# Altium project 2m_DBoard_TX.PrjPcb (part 2 of 2)

## Sheet Power.SchDoc: {Наименование}
size 420 x 297 mm; ApprovedBy: {Утвердил}; CheckedBy: {Проверил}; DrawnBy: {Разраб.}; DocumentNumber: АБВГ 123456.789 00; SheetNumber: {}; SheetTotal: {}; Scale: {Мш.}; PageSetup: Record=PageOptions|CenterHorizontal=False|CenterVertical=False|PrintScale=0.95|XCorrection=0.00|YCorrection=0.00|PrintKind=1|BorderSize=5000000|LeftOffset=0|BottomOffset=0|Orientation=1|PaperLength=1000|PaperWidth=1000|Scale=100|PaperSource=15|PrintQuality=600|MediaType=1|DitherType=10|PaperKind=A4|PrintScaleMode=1; ProcessInspection: {Т.контр.}; Mass: {М.}; NormInspection: {Н.контр.}; Letter1Column: {}; Letter2Column: {}; Letter3Column: {}; DocumentType: {Документ}; Rule: PcbType=ProtelPcb
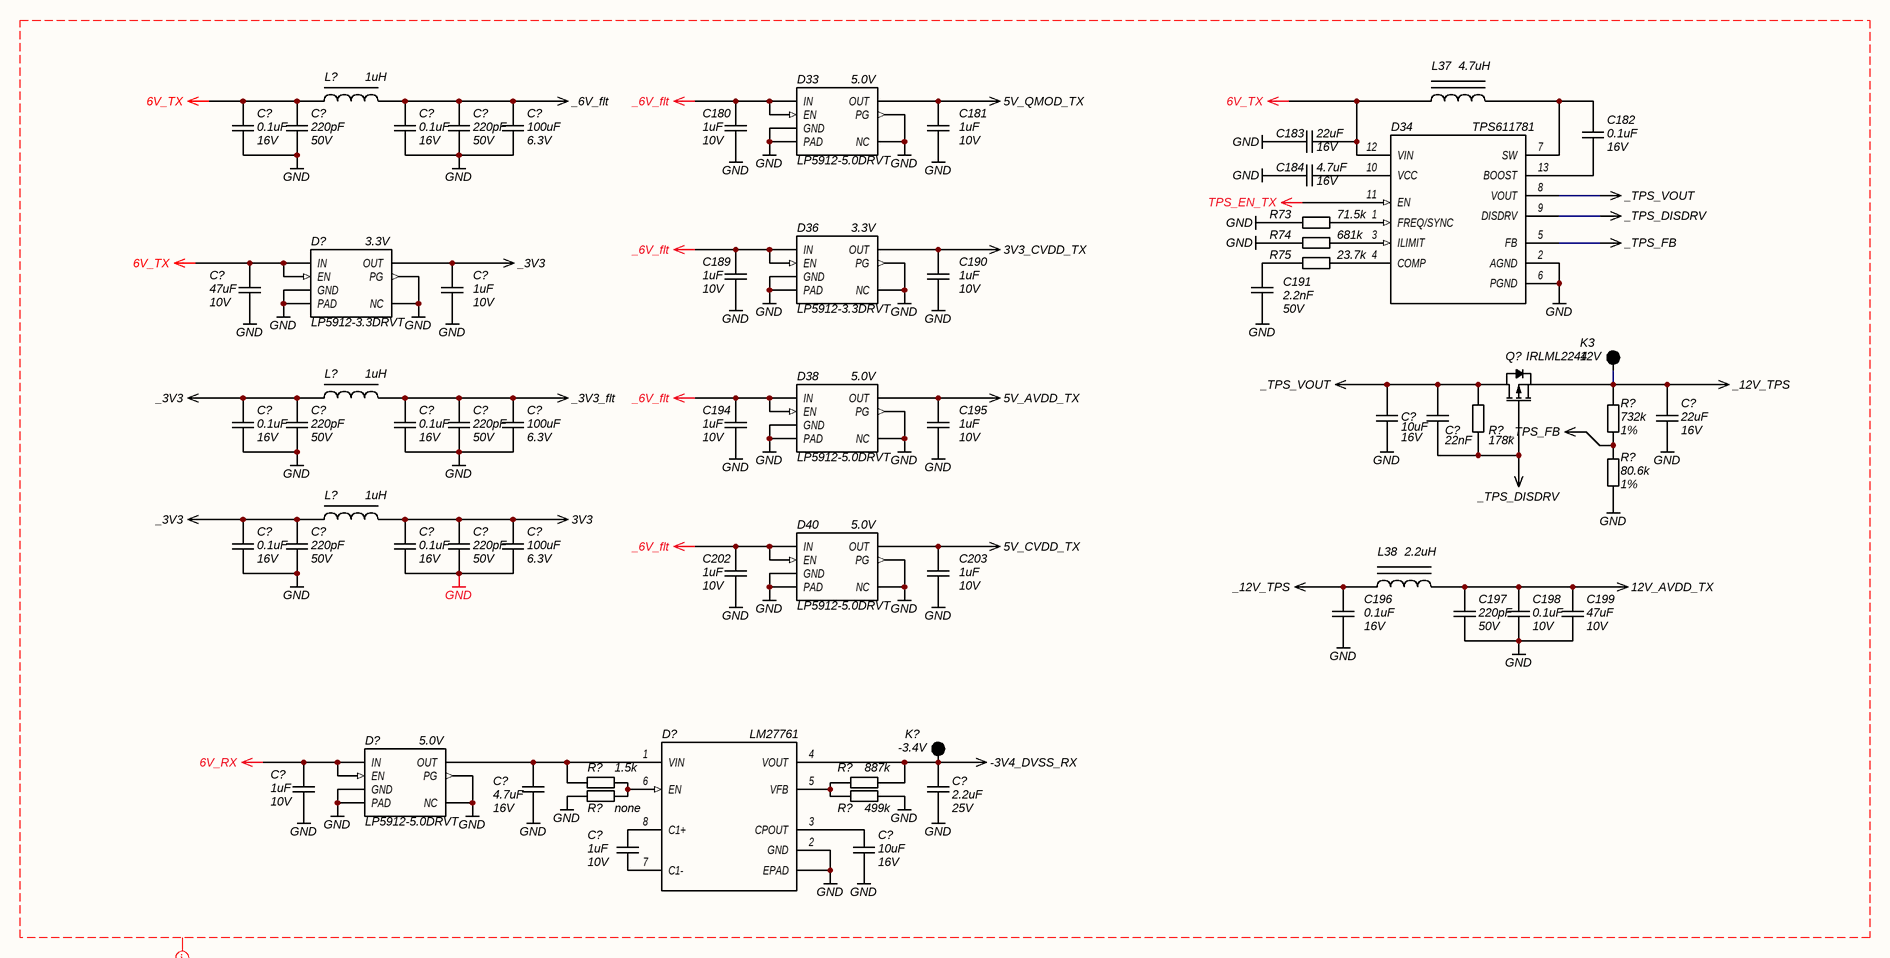
[diagram p6: Power.SchDoc]

### Parts
(Parts that share a designator on the sheet are numbered #1, #2 ... from top to bottom, then left to right.)
C180  value 1uF  Voltage: 10V  [C0805]  (hidden comment: CAP)
C181  value 1uF  Voltage: 10V  [C0805]  (hidden comment: CAP)
C182  value 0.1uF  Voltage: 16V  [C0402]  (hidden comment: CAP)
C183  value 22uF  Voltage: 16V  [C0805]  (hidden comment: CAP uF)
C184  value 4.7uF  Voltage: 16V  [C0603]  (hidden comment: CAP)
C189  value 1uF  Voltage: 10V  [C0805]  (hidden comment: CAP)
C190  value 1uF  Voltage: 10V  [C0805]  (hidden comment: CAP)
C191  value 2.2nF  Voltage: 50V  [C0603]  (hidden comment: CAP)
C194  value 1uF  Voltage: 10V  [C0805]  (hidden comment: CAP)
C195  value 1uF  Voltage: 10V  [C0805]  (hidden comment: CAP)
C196  value 0.1uF  Voltage: 16V  [C0402]  (hidden comment: CAP)
C197  value 220pF  Voltage: 50V  [C0603]  (hidden comment: CAP)
C198  value 0.1uF  Voltage: 10V  [C0402]  (hidden comment: CAP)
C199  value 47uF  Voltage: 10V  [C1210]  (hidden comment: CAP uF)
C202#2  value 1uF  Voltage: 10V  [C0805]  (hidden comment: CAP)
C203#2  value 1uF  Voltage: 10V  [C0805]  (hidden comment: CAP)
C?#3  value 0.1uF  Voltage: 16V  [C0402]  (hidden comment: CAP)
C?#4  value 220pF  Voltage: 50V  [C0603]  (hidden comment: CAP)
C?#5  value 0.1uF  Voltage: 16V  [C0402]  (hidden comment: CAP)
C?#6  value 220pF  Voltage: 50V  [C0603]  (hidden comment: CAP)
C?#7  value 100uF  Voltage: 6.3V  [C1210]  (hidden comment: CAP uF)
C?#8  value 47uF  Voltage: 10V  [C1210]  (hidden comment: CAP uF)
C?#9  value 1uF  Voltage: 10V  [C0805]  (hidden comment: CAP)
C?#10  value 10uF  Voltage: 16V  [C0805]  (hidden comment: CAP uF)
C?#11  value 22nF  [C0402]  (hidden comment: CAP)
C?#12  value 22uF  Voltage: 16V  [C0805]  (hidden comment: CAP uF)
C?#13  value 0.1uF  Voltage: 16V  [C0402]  (hidden comment: CAP)
C?#14  value 220pF  Voltage: 50V  [C0603]  (hidden comment: CAP)
C?#15  value 0.1uF  Voltage: 16V  [C0402]  (hidden comment: CAP)
C?#16  value 220pF  Voltage: 50V  [C0603]  (hidden comment: CAP)
C?#17  value 100uF  Voltage: 6.3V  [C1210]  (hidden comment: CAP uF)
C?#18  value 0.1uF  Voltage: 16V  [C0402]  (hidden comment: CAP)
C?#19  value 220pF  Voltage: 50V  [C0603]  (hidden comment: CAP)
C?#20  value 0.1uF  Voltage: 16V  [C0402]  (hidden comment: CAP)
C?#21  value 220pF  Voltage: 50V  [C0603]  (hidden comment: CAP)
C?#22  value 100uF  Voltage: 6.3V  [C1210]  (hidden comment: CAP uF)
C?#23  value 1uF  Voltage: 10V  [C0805]  (hidden comment: CAP)
C?#24  value 4.7uF  Voltage: 16V  [C0603]  (hidden comment: CAP)
C?#25  value 2.2uF  Voltage: 25V  [C0603]  (hidden comment: CAP)
C?#26  value 1uF  Voltage: 10V  [C0805]  (hidden comment: CAP)
C?#27  value 10uF  Voltage: 16V  [C0805]  (hidden comment: CAP uF)
D33  Name: LP5912-5.0DRVT  Voltage: 5.0V  [WSON-6]  (hidden comment: LP5912)
D34  TPS611781  [TPS611781x]
D36  Name: LP5912-3.3DRVT  Voltage: 3.3V  [WSON-6]  (hidden comment: LP5912)
D38  Name: LP5912-5.0DRVT  Voltage: 5.0V  [WSON-6]  (hidden comment: LP5912)
D40  Name: LP5912-5.0DRVT  Voltage: 5.0V  [WSON-6]  (hidden comment: LP5912)
D?#1  Name: LP5912-3.3DRVT  Voltage: 3.3V  [WSON-6]  (hidden comment: LP5912)
D?#2  Name: LP5912-5.0DRVT  Voltage: 5.0V  [WSON-6]  (hidden comment: LP5912)
D?#3  LM27761  [WSON-8]
K3  12V  [Control Point]
K?  -3.4V  [Control Point]
L37  value 4.7uH  [XAL4030]  (hidden comment: Inductor PWR)
L38  value 2.2uH  [XAL4020]  (hidden comment: Inductor PWR)
L?#1  value 1uH  [L1210_Murata LQH]  (hidden comment: Inductor LF)
L?#2  value 1uH  [L1210_Murata LQH]  (hidden comment: Inductor LF)
L?#3  value 1uH  [L1210_Murata LQH]  (hidden comment: Inductor LF)
Q?  IRLML2244  [SOT-23]
R73  value 71.5k  [R0402]  (hidden comment: RES)
R74  value 681k  [R0402]  (hidden comment: RES)
R75  value 23.7k  [R0603]  (hidden comment: RES)
R?#1  value 178k  [R0402]  (hidden comment: RES)
R?#2  value 732k  Tolerance: 1%  [R0402]  (hidden comment: RES)
R?#3  value 80.6k  Tolerance: 1%  [R0402]  (hidden comment: RES)
R?#4  value 1.5k  [R0402]  (hidden comment: RES)
R?#5  value 887k  [R0402]  (hidden comment: RES)
R?#6  value none  [R0603]  (hidden comment: RES)
R?#7  value 499k  [R0402]  (hidden comment: RES)

### Nets
3V3: C?#20.2 C?#21.2 C?#22.2 L?#3.2
3V3_CVDD_TX: C190.1 D36.1(OUT)
5V_AVDD_TX: C195.1 D38.1(OUT)
5V_CVDD_TX: C203#2.1 D40.1(OUT)
5V_QMOD_TX: C181.1 D33.1(OUT)
6V_RX: C?#23.1 D?#2.4(EN) D?#2.6(IN)
6V_TX: C183.1 C?#3.2 C?#4.2 C?#8.2 D34.12(VIN) D?#1.4(EN) D?#1.6(IN) L37.1 L?#1.1
12V_AVDD_TX: C197.2 C198.2 C199.2 L38.2
-3V4_DVSS_RX: C?#25.1 D?#3.4(VOUT) K?.1 R?#5.2
_3V3: C?#9.1 C?#13.2 C?#14.2 C?#18.2 C?#19.2 D?#1.1(OUT) L?#2.1 L?#3.1
_3V3_flt: C?#15.2 C?#16.2 C?#17.2 L?#2.2
_6V_flt: C180.1 C189.1 C194.1 C202#2.1 C?#5.2 C?#6.2 C?#7.2 D33.4(EN) D33.6(IN) D36.4(EN) D36.6(IN) D38.4(EN) D38.6(IN) D40.4(EN) D40.6(IN) L?#1.2
_12V_TPS: C196.2 C?#12.2 K3.1 L38.1 Q?.2(S) R?#2.2
_TPS_DISDRV: C?#11.2 D34.9(DISDRV) Q?.1(G) R?#1.1
_TPS_FB: D34.5(FB) R?#2.1 R?#3.2
_TPS_VOUT: C?#10.2 C?#11.1 D34.8(VOUT) Q?.3(D) R?#1.2
GND: C180.2 C181.2 C183.2 C184.2 C189.2 C190.2 C191.1 C194.2 C195.2 C196.1 C197.1 C198.1 C199.1 C202#2.2 C203#2.2 C?#3.1 C?#4.1 C?#5.1 C?#6.1 C?#7.1 C?#8.1 C?#9.2 C?#10.1 C?#12.1 C?#13.1 C?#14.1 C?#15.1 C?#16.1 C?#17.1 C?#18.1 C?#19.1 C?#20.1 C?#21.1 C?#22.1 C?#23.2 C?#24.2 C?#25.2 C?#27.2 D33.0(PAD) D33.2(NC) D33.3(PG) D33.5(GND) D34.2(AGND) D34.6(PGND) D36.0(PAD) D36.2(NC) D36.3(PG) D36.5(GND) D38.0(PAD) D38.2(NC) D38.3(PG) D38.5(GND) D40.0(PAD) D40.2(NC) D40.3(PG) D40.5(GND) D?#1.0(PAD) D?#1.2(NC) D?#1.3(PG) D?#1.5(GND) D?#2.0(PAD) D?#2.2(NC) D?#2.3(PG) D?#2.5(GND) D?#3.0(EPAD) D?#3.2(GND) R73.1 R74.1 R?#3.1 R?#6.1 R?#7.2
TPS_EN_TX: D34.11(EN)
NetC182_1: C182.1 D34.13(BOOST)
NetC182_2: C182.2 D34.7(SW) L37.2
NetC184_1: C184.1 D34.10(VCC)
NetC191_2: C191.2 R75.1
NetC?#24_1: C?#24.1 D?#2.1(OUT) D?#3.1(VIN) R?#4.2
NetC?#26_1: C?#26.1 D?#3.7(C1-)
NetC?#26_2: C?#26.2 D?#3.8(C1+)
NetC?#27_1: C?#27.1 D?#3.3(CPOUT)
NetD34_1: D34.1(FREQ/SYNC) R73.2
NetD34_3: D34.3(ILIMIT) R74.2
NetD34_4: D34.4(COMP) R75.2
NetD?#3_5: D?#3.5(VFB) R?#5.1 R?#7.1
NetD?#3_6: D?#3.6(EN) R?#4.1 R?#6.2

### Layout directives
net class POWER: 3V3, 3V3_CVDD_TX, 5V_AVDD_TX, 5V_CVDD_TX, 5V_QMOD_TX, 6V_RX, 6V_TX, 12V_AVDD_TX, -3V4_DVSS_RX, _3V3, _3V3_flt, _6V_flt, _12V_TPS, _TPS_DISDRV, _TPS_FB, _TPS_VOUT, GND, TPS_EN_TX

### Notes on the sheet
- Перв. примен.
- Справ. №
- Подп. и дата
- Инв. № дубл.
- Взам. инв. №
- Изм.
- Лист
- № докум.
- Подп.
- Дата
- Лит.
- Масса
- Масштаб
- Т.контр.
- Пров.
- Разраб.
- Листов
- Инв. № подл.
- Н.контр.
- Утв.
- Копировал
- Формат А3

### Library data of the parts
C180 C181 C189 C190 C194 C195 C202#2 C203#2 C?#9 C?#23 C?#26 = CAP: SMD Capacitor; Manufacturer: Murata; Material: X7R; Tolerance: 10%; Type: Ceramic Capacitor; P/N: GRM21BR71A105KA01K
C182 C196 = CAP: SMD Capacitor; Manufacturer: Murata; Material: X5R; Tolerance: ±10%; Type: Ceramic Capacitor; P/N: GRM155R61C104KA88D
C183 C?#12 = CAP uF: SMD Capacitor; Manufacturer: Murata; Material: X5R; Tolerance: ±20%; Type: Ceramic Capacitor; P/N: GRM21BR61C226ME44L
C184 C?#24 = CAP: SMD Capacitor; Manufacturer: Murata; Material: X5R; Tolerance: 10%; Type: Ceramic Capacitor; P/N: GRM188R61C475KAAJD
C191 = CAP: SMD Capacitor; Manufacturer: Murata; Material: NP0; Tolerance: ±5%; Type: Ceramic Capacitor; P/N: GRM1885C1H222JA01D
C197 C?#4 C?#6 C?#14 C?#16 C?#19 C?#21 = CAP: SMD Capacitor; Manufacturer: Murata; Material: X7R; Tolerance: 10%; Type: Ceramic Capacitor; P/N: GRM188R71H221KA01D
C198 = CAP: SMD Capacitor; Manufacturer: Murata; Material: X7R; Tolerance: 10%; Type: Ceramic Capacitor; P/N: GRM155R71A104KA01J
C199 C?#8 = CAP uF: SMD Capacitor; Manufacturer: Murata; Material: X7R; Tolerance: 10%; Type: Ceramic Capacitor; P/N: GRM32ER71A476KE15L
C?#3 C?#5 C?#13 C?#15 C?#18 C?#20 = CAP: SMD Capacitor; Manufacturer: Murata; Material: X7R; Tolerance: 10%; Type: Ceramic Capacitor; P/N: GRM155R71C104KA88J
C?#7 C?#17 C?#22 = CAP uF: SMD Capacitor; Manufacturer: Murata; Material: X5R; Tolerance: 20%; Type: Ceramic Capacitor; P/N: GRM32ER60J107ME20L
C?#10 C?#27 = CAP uF: SMD Capacitor; Manufacturer: Murata; Material: X5R; Tolerance: ±10%; Type: Ceramic Capacitor; P/N: GRM21BR61C106KE15K
C?#11 = CAP: SMD Capacitor; Manufacturer: Murata; Material: X7R; Tolerance: 10%; Voltage: 50V; Type: Ceramic Capacitor; P/N: GCM155R71H223KA55D
C?#25 = CAP: SMD Capacitor; Manufacturer: Murata; Material: X5R; Tolerance: 10%; Type: Ceramic Capacitor; P/N: GRM188R61E225KA12D
D33 D36 D38 D40 D?#1 D?#2 = LP5912: LP5912 500-mA Low-Noise, Low-IQ LDO; Manufacturer: Texas Instruments; Type: Low-Noise LDO; Current: 500mA; Package: WSON; Temperature Range: –40°C to 125°C; Supplier 1: Digi-Key; Supplier Part Number 1: 296-44153-2-ND
  D33 D38 D40 D?#2: P/N: LP5912-5.0DRVT
  D36 D?#1: P/N: LP5912-3.3DRVT
D34 = TPS611781: 10-A Fully-Integrated Synchronous Boost with Load Disconnect Control; Manufacturer: Texas Instruments; Voltage: 4.5 V to 20 V; P/N: TPS611781RNW; Current: 10 A; Name: TPS611781; Package: 13-VQFN-HR (3.5x3.0); Temperature Range: –40°C to 125°C; Type: Synchronous Boost; Supplier 1: Digi-Key; Supplier Part Number 1: 296-46568-1-ND
D?#3 = LM27761: Low-Noise, Regulated, Switched-Capacitor Voltage Inverter; Manufacturer: Texas Instruments; Voltage: 2.7 V to 5.5; P/N: LM27761DSGT; Current: 250 mA; Name: LM27761; Package: WSON; Temperature Range: –40°C to 125°C; Type: Voltage Inverter
K3 K? = Test  Point
L37 = Inductor PWR: Magnetic-Core Inductor; Manufacturer: Coilcraft; Name: XEL4030-472MEB; Current: 5A; Tolerance: ±30%; Temperature Range: -40ºC to 125ºC
L38 = Inductor PWR: Magnetic-Core Inductor; Manufacturer: Coilcraft; Name: XEL4020-222MEB; Current: 5.9A; Tolerance: ±30%; Temperature Range: -40ºC to 125ºC
L?#1-L?#3 = Inductor LF: Inductor Power Lines; Manufacturer: Murata; Name: LQH32PN1R0NNC; Current: 2500mA; Tolerance: 5%; Frequency: 100MHz; Temperature Range: -25ºC to 85ºC; Series: LQH; P/N: LQH32PN1R0NNC
Q? = IRLML2244: P-Channel MOSFET; Current: 4.3A; Channel Resistance: 54 mΩ; Power Dissipation: 1.3W; Voltage: -20V; P/N: IRLML2244TRPBF; Name: IRLML2244; Package: SOT-23; Type: P-Channel Mosfet; Value: IRLML2244
R73 = RES: SMD Resistor; Manufacturer: Panasonic Electronic Components; Name: Chip SMD Resistor; Power: 0.063 Wt; Tolerance: 1%; P/N: ERJ-2RKF7152X; Temperature Range: -55…155°C
R74 = RES: SMD Resistor; Manufacturer: Panasonic Electronic Components; Name: Chip SMD Resistor; Power: 0.063 Wt; Tolerance: 1%; P/N: ERJ-2RKF6813X; Temperature Range: -55…155°C
R75 = RES: SMD Resistor; Manufacturer: Panasonic Electronic Components; Name: Chip SMD Resistor; Power: 0.1 Wt; Tolerance: 1%; P/N: ERJ-3EKF2372V; Temperature Range: -55…155°C
R?#1 = RES: SMD Resistor; Manufacturer: Panasonic Electronic Components; Name: Chip SMD Resistor; Power: 0.063 Wt; Tolerance: 1%; P/N: ERJ-2RKF1783X; Temperature Range: -55…155°C
R?#2 = RES: SMD Resistor; Manufacturer: Panasonic Electronic Components; Name: Chip SMD Resistor; Power: 0.063 Wt; P/N: ERJ-2RKF7323X; Temperature Range: -55…155°C
R?#3 = RES: SMD Resistor; Manufacturer: Panasonic Electronic Components; Name: Chip SMD Resistor; Power: 0.063 Wt; P/N: ERJ-2RKF8062X; Temperature Range: -55…155°C
R?#4 = RES: SMD Resistor; Manufacturer: Panasonic Electronic Components; Name: Chip SMD Resistor; Power: 0.063 Wt; Tolerance: 0.5%; P/N: ERJ-2RHD1501X; Temperature Range: -55…155°C
R?#5 = RES: SMD Resistor; Manufacturer: Panasonic Electronic Components; Name: Chip SMD Resistor; Power: 0.1 Wt; Tolerance: ±1%; P/N: ERJ-2RKF8873X; Temperature Range: -55…155°C
R?#6 = RES: SMD Resistor; Name: Chip SMD Resistor; Power: 0.1 Wt; Tolerance: 1%; P/N: ERJ-2GE0R00X; Temperature Range: -55…155°C
R?#7 = RES: SMD Resistor; Manufacturer: Panasonic Electronic Components; Name: Chip SMD Resistor; Power: 0.1 Wt; Tolerance: ±1%; P/N: ERJ-2RKF4993X; Temperature Range: -55…155°C

## Nets that join several sheets
3V3: CPLD (41 pins), Power (C?#20.2 C?#21.2 C?#22.2 L?#3.2)
3V3_CVDD_TX: IF_TX (7 pins), REFCLK (12 pins), Power (C190.1 D36.1)
3V3_DVDD_RX: REFCLK (D15.9), Digital (6 pins)
3V3_DVDD_TX: DBoard_conn (5 pins), TX (C123.2 D27.2 R51.1), REFCLK (C144.2 C160.2 D15.8 D24.8), Digital (8 pins)
5V_AVDD_TX: TX (C117.2 C118.2 L35.1 L36.1), Power (C195.1 D38.1)
5V_CVDD_TX: IF_TX (C92.1 C93.2 C94.2 L31.2), REFCLK (6 pins), Power (C203#2.1 D40.1)
5V_QMOD_TX: IF_TX (6 pins), Power (C181.1 D33.1)
6V_TX: DBoard_conn (X1.4 X1.6), Power (9 pins)
12V_AVDD_TX: TX (C124.2 C125.2 L42.1), Power (C197.2 C198.2 C199.2 L38.2)
-3V4_DVSS_RX: Digital (R67.1 R70.1), Power (C?#25.1 D?#3.4 K?.1 R?#5.2)
AGND: REFCLK (C156.2 C158.2), Digital (XC2.2)
cpld_io_00: CPLD (R90.2), DBoard_conn (X1.35)
cpld_io_01: CPLD (R89.6), DBoard_conn (X1.33)
cpld_io_02: CPLD (R89.7), DBoard_conn (X1.31)
cpld_io_03: CPLD (R89.8), DBoard_conn (X1.29)
cpld_io_04: CPLD (R87.5), DBoard_conn (X1.27)
cpld_io_05: CPLD (R87.6), DBoard_conn (X1.25)
cpld_io_06: CPLD (R87.7), DBoard_conn (X1.23)
cpld_io_07: CPLD (R87.8), DBoard_conn (X1.21)
cpld_io_08: CPLD (R84.5), DBoard_conn (X1.19)
cpld_io_09: CPLD (R84.6), DBoard_conn (X1.17)
cpld_io_10: CPLD (R84.7), DBoard_conn (X1.15)
cpld_io_11: CPLD (R84.8), DBoard_conn (X1.13)
cpld_io_12: CPLD (R82.5), DBoard_conn (X1.11)
cpld_io_13: CPLD (R82.6), DBoard_conn (X1.9)
cpld_io_14: CPLD (R82.7), DBoard_conn (X1.7)
cpld_io_15: CPLD (R82.8), DBoard_conn (X1.5)
GND: CPLD (47 pins), DBoard_conn (26 pins), IF_TX (64 pins), TX (96 pins), REFCLK (24 pins), Digital (63 pins), Power (71 pins)
HFreq_TX: IF_TX (D21.24), TX (D25.4)
HFreq_UpMxd_TX: IF_TX (D17#2.2), TX (Z12.IN)
I2C_A0_TX: DBoard_conn (X1.22), Digital (D31.1)
I2C_A1_TX: DBoard_conn (X1.20), Digital (D31.2)
LED_TX: CPLD (D16.L16), Digital (T9.1)
LFreq_DownMxd_TX: IF_TX (D19.2), TX (Z11.IN)
MISO_TX: CPLD (R79.7), DBoard_conn (X1.32)
MOSI_TX: CPLD (R79.6), DBoard_conn (X1.34), TX (D27.18)
PLL2_RX_STAT: REFCLK (D15.3), Digital (C175.1 T7.1)
ref_freq_tx_n: DBoard_conn (X1.14), IF_TX (C115.2)
ref_freq_tx_p: DBoard_conn (X1.12), IF_TX (C113.2)
SCL_TX: DBoard_conn (X1.16), Digital (D31.6)
SCLK_TX: CPLD (R79.8), DBoard_conn (X1.30), TX (D27.17)
SDA_TX: DBoard_conn (X1.18), Digital (D31.5)
SEN_TX: CPLD (R79.5), DBoard_conn (X1.36)
TX_IOUTA_N: DBoard_conn (X1.61), IF_TX (C88.2 L29.1 R38.2)
TX_IOUTB_N: DBoard_conn (X1.49), IF_TX (C78.2 L25.1 R35.2)
TX_IOUTB_P: DBoard_conn (X1.51), IF_TX (C78.1 L23.1 R33.1)